# Altium schematic sheet RELAY.SchDoc
size A4; SheetNumber: 6; SheetTotal: 6
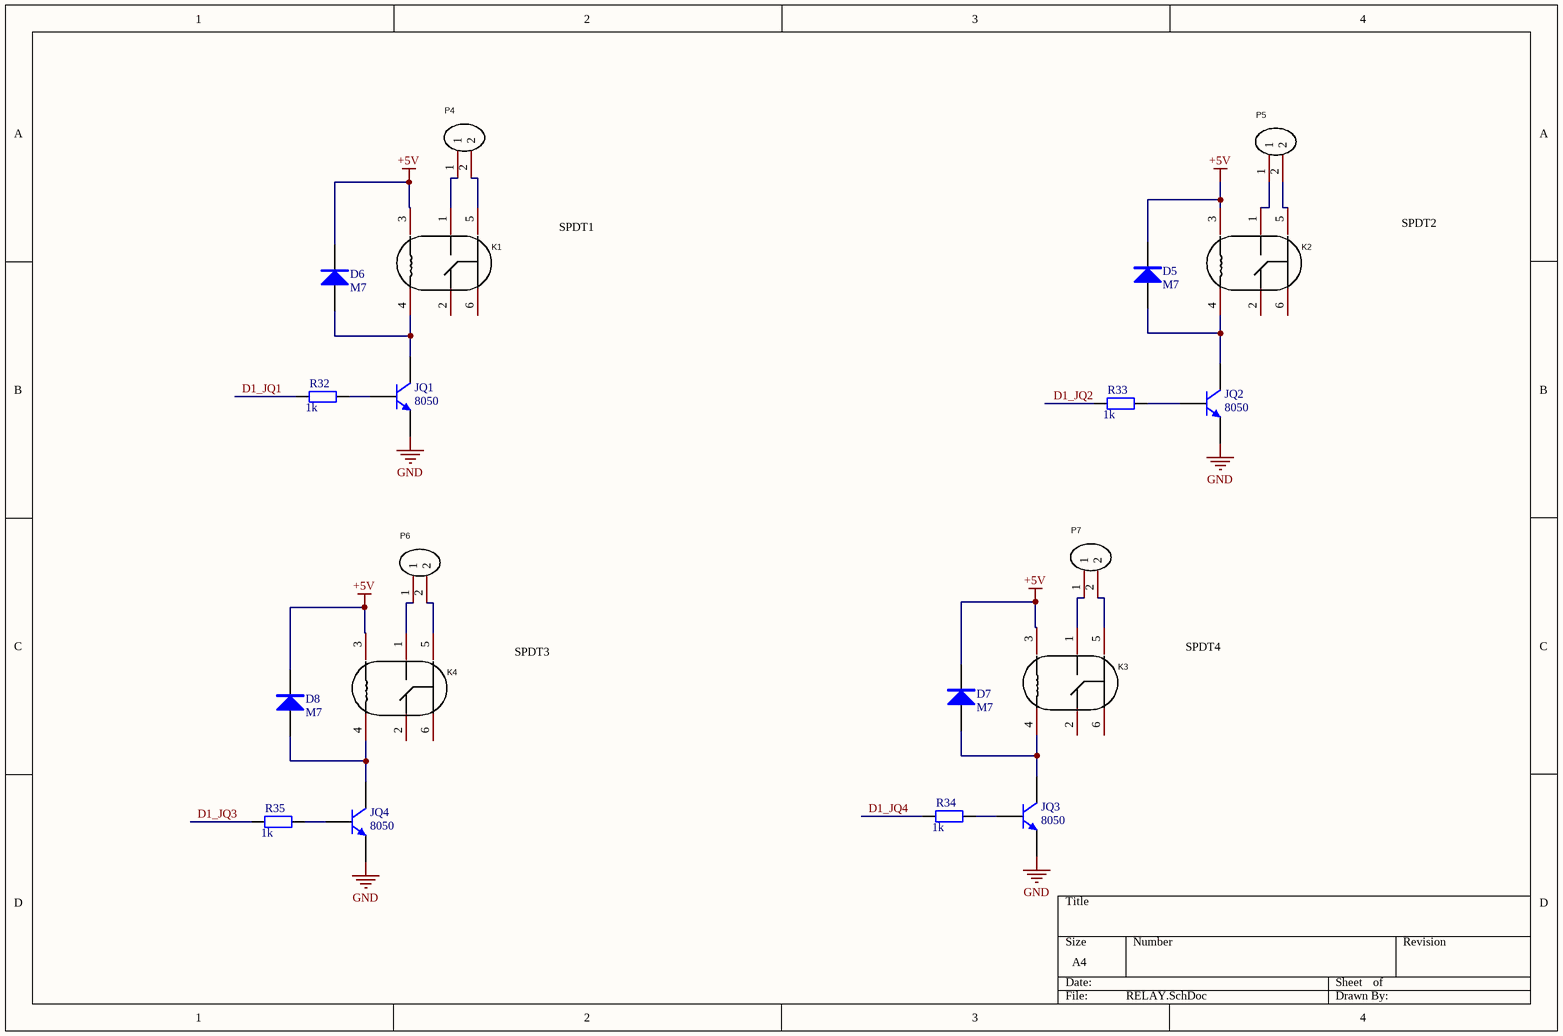
[diagram p0: RELAY.SchDoc]

## Parts
D5  M7  [DO-214AC]
D6  M7  [DO-214AC]
D7  M7  [DO-214AC]
D8  M7  [DO-214AC]
JQ1  8050  [SOT-23-3_(三极管)]
JQ2  8050  [SOT-23-3_(三极管)]
JQ3  8050  [SOT-23-3_(三极管)]
JQ4  8050  [SOT-23-3_(三极管)]
K1  HK4100F-DC5V-SHG  [HK4100F]  (value not drawn)
K2  HK4100F-DC5V-SHG  [HK4100F]  (value not drawn)
K3  HK4100F-DC5V-SHG  [HK4100F]  (value not drawn)
K4  HK4100F-DC5V-SHG  [HK4100F]  (value not drawn)
P4  WJ500V-5.08-2P  [KF128-2P DG128]  (value not drawn)
P5  WJ500V-5.08-2P  [KF128-2P DG128]  (value not drawn)
P6  WJ500V-5.08-2P  [KF128-2P DG128]  (value not drawn)
P7  WJ500V-5.08-2P  [KF128-2P DG128]  (value not drawn)
R32  1k  [R-0805]
R33  1k  [R-0805]
R34  1k  [R-0805]
R35  1k  [R-0805]

## Nets
+5V: D5.2(K) D6.2(K) D7.2(K) D8.2(K) K1.3 K2.3 K3.3 K4.3
GND: JQ1.2(E) JQ2.2(E) JQ3.2(E) JQ4.2(E)
D1_JQ1: R32.2
D1_JQ2: R33.2
D1_JQ3: R35.2
D1_JQ4: R34.2
NetD5_1: D5.1(A) JQ2.3(C) K2.4
NetD6_1: D6.1(A) JQ1.3(C) K1.4
NetD7_1: D7.1(A) JQ3.3(C) K3.4
NetD8_1: D8.1(A) JQ4.3(C) K4.4
NetJQ1_1: JQ1.1(B) R32.1
NetJQ2_1: JQ2.1(B) R33.1
NetJQ3_1: JQ3.1(B) R34.1
NetJQ4_1: JQ4.1(B) R35.1
NetK1_1: K1.1 P4.1
NetK1_5: K1.5 P4.2
NetK2_1: K2.1 P5.1
NetK2_5: K2.5 P5.2
NetK3_1: K3.1 P7.1
NetK3_5: K3.5 P7.2
NetK4_1: K4.1 P6.1
NetK4_5: K4.5 P6.2

Not connected (* = marked no-connect by the designer): K1 2 6; K2 2 6; K3 2 6; K4 2 6

## Notes on the sheet
- SPDT1
- SPDT2
- SPDT3
- SPDT4

## Library data of the parts
D5-D8 = DIODE: 二极管
JQ1-JQ4 = NPN
K1-K4 = HK4100F-DC5V-SHG: Manufacturer: 汇科; Add into BOM: yes; Name: HK4100F-DC5V-SHG; Symbol: HK4100F-DC5V-SHG; Device: HK4100F-DC5V-SHG; LCSC Part Name: HK4100F-DC5V-SHG; Supplier Part: C12072; Manufacturer Part: HK4100F-DC5V-SHG; Supplier Footprint: DIP,10.5x14.5mm; JLCPCB Part Class: Extended Part; Datasheet: https://atta.szlcsc.com/upload/public/pdf/source/20180316/5A66D26635AF047552DED4727B242686.pdf; Supplier: LCSC; Convert to PCB: yes; Coil Voltage: -; Contact Form: -; Pin Number: -; Contact Rating: -; Maximum Switching Voltage: -; Contact Material: -; Maximum Switching Current: -; Coil Type: -; Coil Resistance: -; Contact Resistance: -; Operate Time: -; Release Time: -; Operating Temperature: -
P4-P7 = WJ500V-5.08-2P: Manufacturer: KANGNEX(康奈克斯电气); Symbol: WJ500V-5.08-2P-14-00A; Add into BOM: yes; Pitch: 5.08mm; Structure: 1x2P; Number of PINs Per Row: 2; Current Rating (Max): 18A; Voltage Rating (Max): 250V; Wire Gauge - AWG: 14~30; Wire Gauge - mm2: 2.5; Name: WJ500V-5.08-2P; Device: WJ500V-5.08-2P; LCSC Part Name: 5.08mm 1x2P 排数:1 每排P数:2 直针 可拼接; Supplier Part: C8465; Manufacturer Part: WJ500V-5.08-2P; Supplier Footprint: 插件,P=5.08mm; JLCPCB Part Class: Extended Part; Datasheet: https://atta.szlcsc.com/upload/public/pdf/source/20191225/C8465_02D34CE5B5B4A53DF5891601D97FA9F4.pdf; Supplier: LCSC; Convert to PCB: yes; Number of Rows: 1; Mounting Style: 直针; Operating Temperature Range: -40℃~+105℃; Color: 绿色
R32-R35 = RES: 电阻; Value: 5.1K; Published: 8-Jun-2000; LatestRevisionDate: 17-Jul-2002; LatestRevisionNote: Re-released for DXP Platform.; PackageReference: AXIAL-0.4; Publisher: Altium Limited